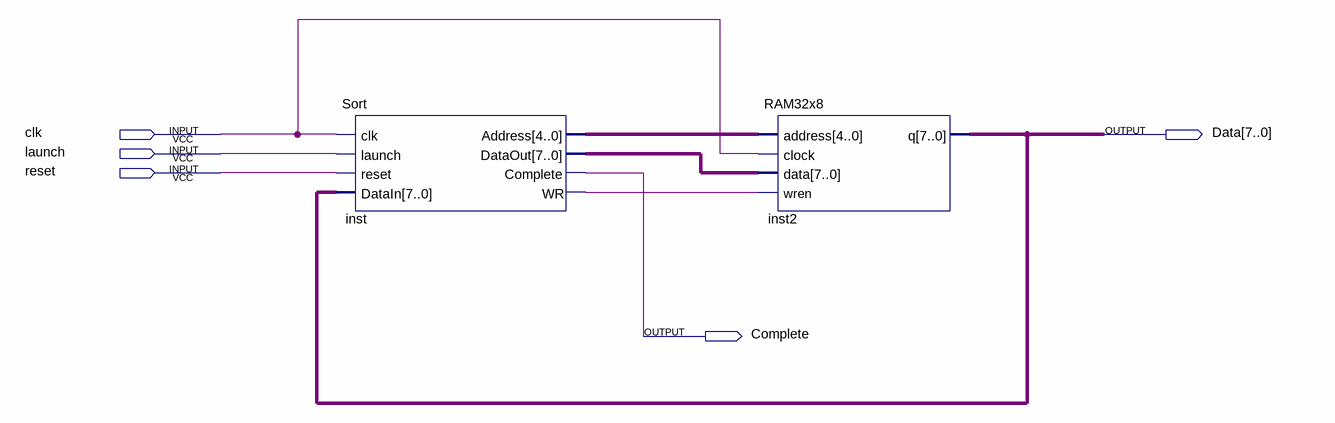
[diagram p0: schematic sheet]
// Quartus schematic Sorter.bdf as structural Verilog: 2 symbols, 5 pins
module Sorter (
  input  clk,
  input  launch,
  input  reset,
  output [7:0] Data,
  output Complete
);

  wire inst_wr;
  wire [4:0] inst_address;
  wire [7:0] inst_dataout;

  Sort inst (
    .clk(clk), .launch(launch), .reset(reset), .DataIn(Data), .Address(inst_address), .DataOut(inst_dataout),
    .Complete(Complete), .WR(inst_wr));
  RAM32x8 inst2 (.address(inst_address), .clock(clk), .data(inst_dataout), .wren(inst_wr), .q(Data));
endmodule
